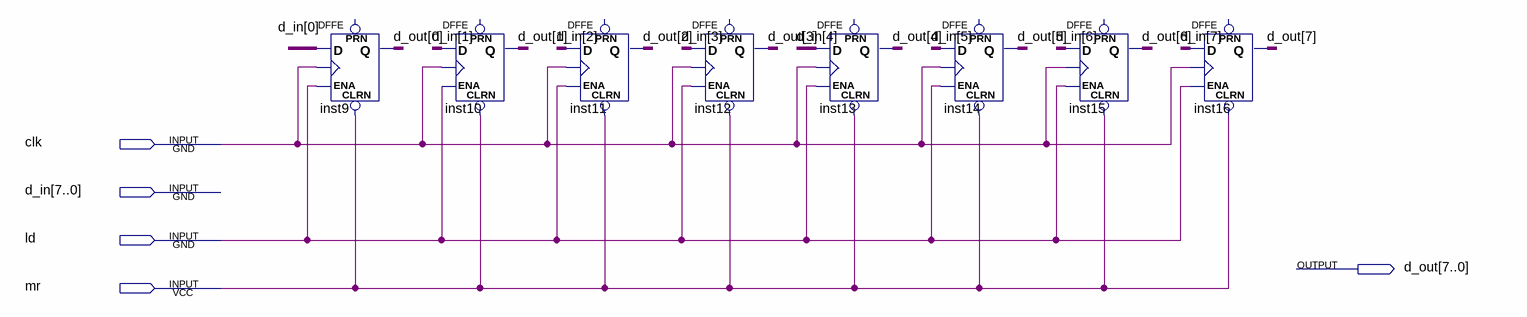
[diagram p0: schematic sheet]
// Quartus schematic reg_8b.bdf as structural Verilog: 8 symbols, 5 pins
module reg_8b (
  input  clk,
  input  [7:0] d_in,
  input  ld,
  input  mr,
  output [7:0] d_out
);

  DFFE inst9 (.CLRN(mr), .D(d_in[0]), .CLK(clk), .ENA(ld), .Q(d_out[0]));  // open: PRN
  DFFE inst10 (.CLRN(mr), .D(d_in[1]), .CLK(clk), .ENA(ld), .Q(d_out[1]));  // open: PRN
  DFFE inst11 (.CLRN(mr), .D(d_in[2]), .CLK(clk), .ENA(ld), .Q(d_out[2]));  // open: PRN
  DFFE inst12 (.CLRN(mr), .D(d_in[3]), .CLK(clk), .ENA(ld), .Q(d_out[3]));  // open: PRN
  DFFE inst13 (.CLRN(mr), .D(d_in[4]), .CLK(clk), .ENA(ld), .Q(d_out[4]));  // open: PRN
  DFFE inst14 (.CLRN(mr), .D(d_in[5]), .CLK(clk), .ENA(ld), .Q(d_out[5]));  // open: PRN
  DFFE inst15 (.CLRN(mr), .D(d_in[6]), .CLK(clk), .ENA(ld), .Q(d_out[6]));  // open: PRN
  DFFE inst16 (.CLRN(mr), .D(d_in[7]), .CLK(clk), .ENA(ld), .Q(d_out[7]));  // open: PRN
endmodule
